# EAGLE design ZX_Distance_and_Gesture_Sensor_PTH (EAGLE 7.2.0)
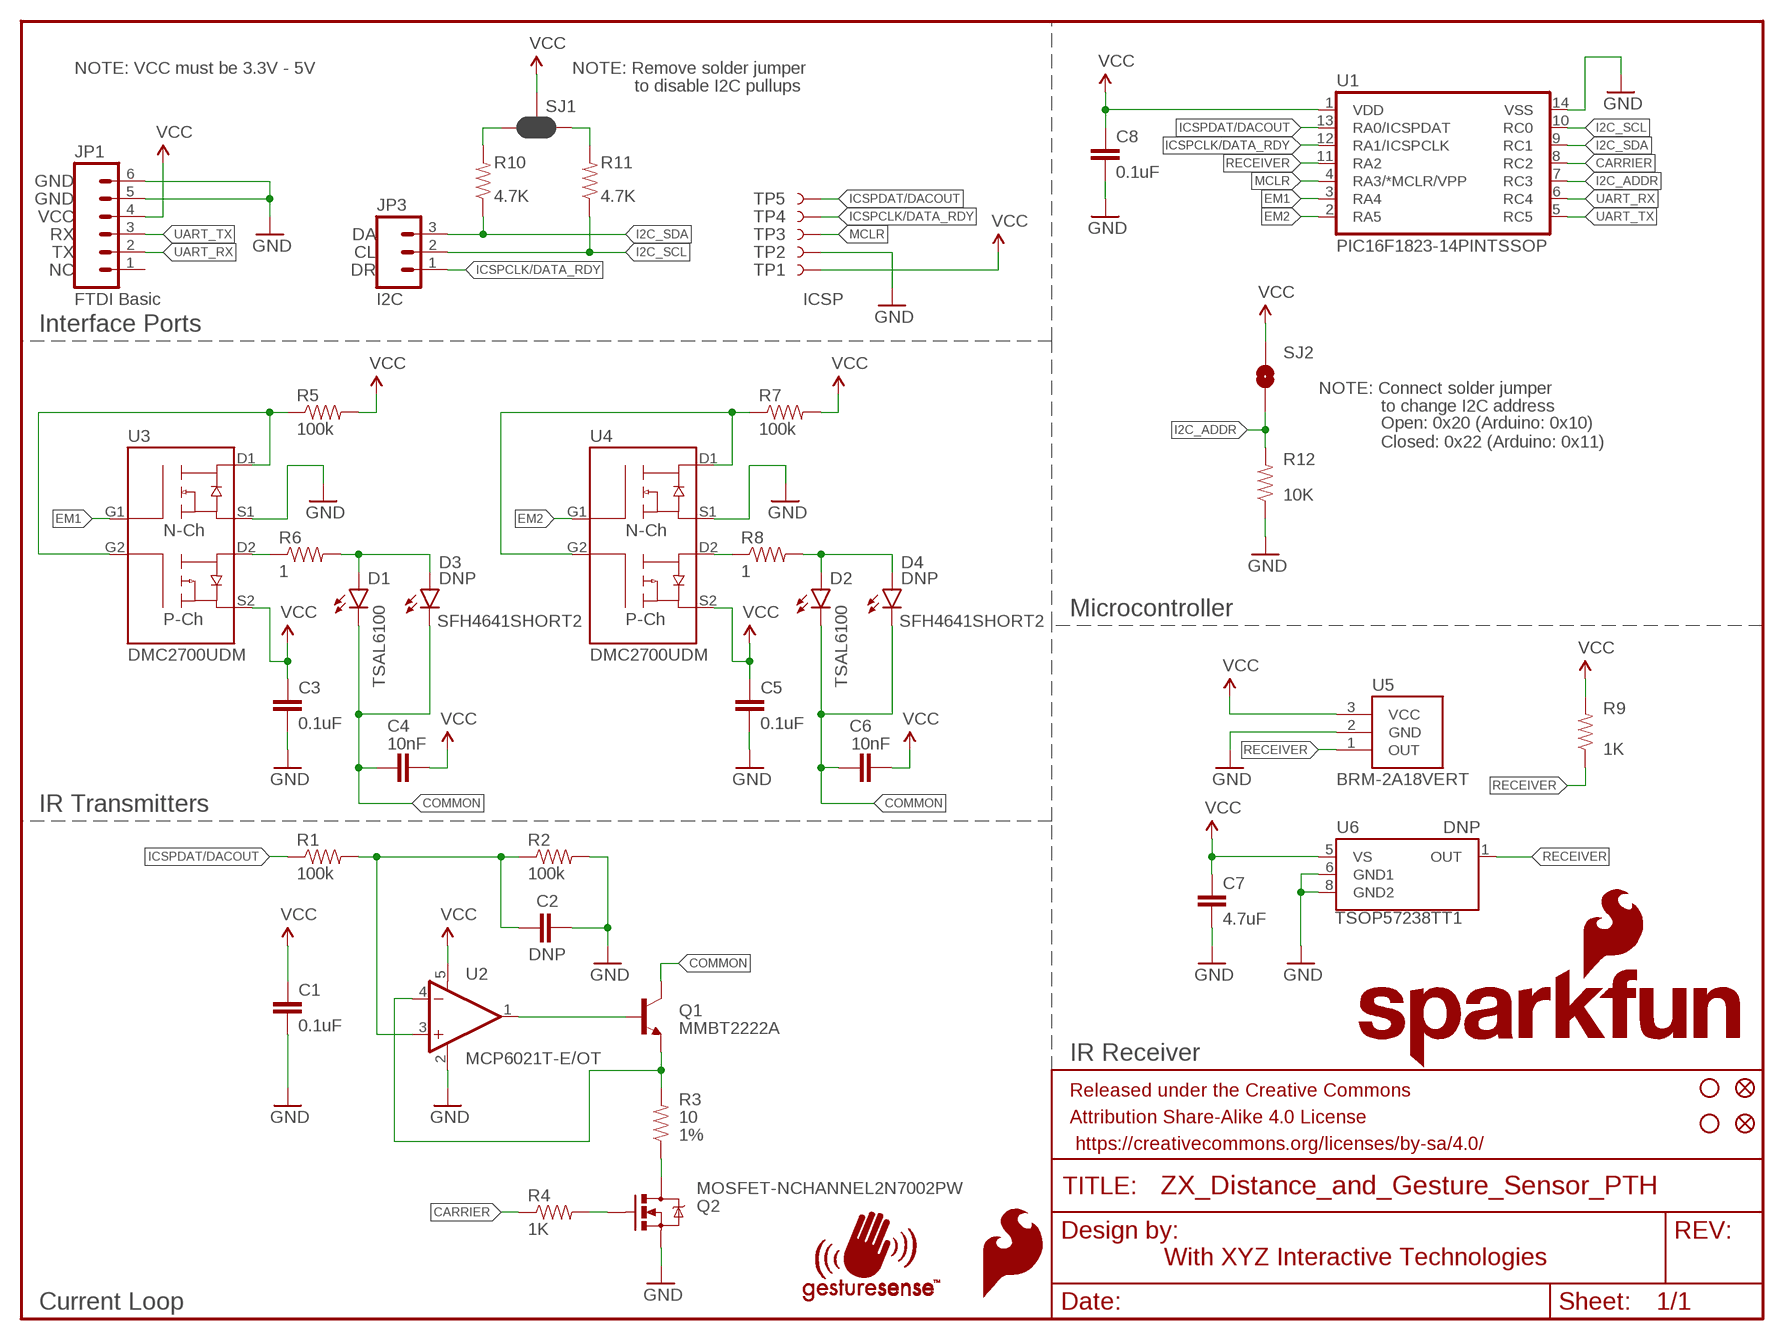
[diagram p0: schematic, sheet 1]

## Parts
C1  0.1uF  0.1UF-25V(+80/-20%)(0603)  [0603-CAP]
C2  DNP  CAP0603-CAP  [0603-CAP]
C3  0.1uF  0.1UF-25V(+80/-20%)(0603)  [0603-CAP]
C4  10nF  10NF/10000PF-50V-10%(0603)  [0603-CAP]
C5  0.1uF  0.1UF-25V(+80/-20%)(0603)  [0603-CAP]
C6  10nF  10NF/10000PF-50V-10%(0603)  [0603-CAP]
C7  4.7uF  4.7UF-6.3V-10%(0603)0603  [0603-CAP]
C8  0.1uF  0.1UF-25V(+80/-20%)(0603)  [0603-CAP]
D1  LED-IR-THRUTSAL6100  [LED5MM]
D2  LED-IR-THRUTSAL6100  [LED5MM]
D3  SFH4641SHORT2  [SFH4641-SHORT2]
D4  SFH4641SHORT2  [SFH4641-SHORT2]
FID1  FIDUCIAL1X2  [FIDUCIAL-1X2]
FID2  FIDUCIAL1X2  [FIDUCIAL-1X2]
FRAME1  FRAME-LETTER  [CREATIVE_COMMONS]
JP1  M06NO_SILK_FEMALE_PTH  [1X06_NO_SILK]
JP3  M031X03_NO_SILK  [1X03_NO_SILK]
LOGO1  SFE_LOGO_FLAME.1_INCH  [SFE_LOGO_FLAME_.1]
Q1  MMBT2222A  TRANSISTOR_NPNMMBT2222A  [SOT23-3]
Q2  MOSFET-NCHANNEL2N7002PW  [SOT323]
R1  100k  100KOHM-1/10W-1%(0603)  [0603-RES]
R2  100k  100KOHM-1/10W-1%(0603)  [0603-RES]
R3  10  10OHM-1/10W-1%(0603)SMD  [0603-RES]
R4  1K  1KOHM-1/10W-1%(0603)  [0603-RES]
R5  100k  100KOHM-1/10W-1%(0603)  [0603-RES]
R6  1  1OHM1/10W1%(0603)  [0603-RES]
R7  100k  100KOHM-1/10W-1%(0603)  [0603-RES]
R8  1  1OHM1/10W1%(0603)  [0603-RES]
R9  1K  1KOHM-1/10W-1%(0603)  [0603-RES]
R10  4.7K  4.7KOHM-1/10W-1%(0603)  [0603-RES]
R11  4.7K  4.7KOHM-1/10W-1%(0603)  [0603-RES]
R12  10K  10KOHM-1/10W-1%(0603)0603  [0603-RES]
SJ1  JUMPER-PAD-3-NC_BY_PASTE  [PAD-JUMPER-3-NC_BY_PASTE_YES_SILK_FULL_BOX]
SJ2  JUMPER-PAD-2-NOYES_SILK  [PAD-JUMPER-2-NO_YES_SILK]
STANDOFF1  STAND-OFF  [STAND-OFF]
STANDOFF2  STAND-OFF  [STAND-OFF]
TP1  TEST-POINT3X4  [PAD.03X.04]
TP2  TEST-POINT3X4  [PAD.03X.04]
TP3  TEST-POINT3X4  [PAD.03X.04]
TP4  TEST-POINT3X4  [PAD.03X.04]
TP5  TEST-POINT3X4  [PAD.03X.04]
U1  PIC16F1823-14PINTSSOP  [TSSOP14]
U2  MCP6021T-E/OT  [SOT23-5]
U3  DMC2700UDM  [SOT26]
U4  DMC2700UDM  [SOT26]
U5  BRM-2A18VERT  [BRM-2508_VERT]
U6  TSOP57238TT1  [TSOP572]
U$5  SFE_LOGO_NAME_FLAME.1_INCH  [SFE_LOGO_NAME_FLAME_.1]
U$6  GESTURESENSE_LOGOSTEXT  [GESTURESENSE_TEXT]

## Nets
CARRIER: R4.1 U1.8(RC2)
COMMON: C4.1 C6.1 D1.K(C) D2.K(C) D3.C D4.C Q1.3(C)
EM1: U1.3(RA4) U3.G1
EM2: U1.2(RA5) U4.G1
GND: C1.2 C2.2 C3.2 C5.2 C7.2 C8.2 JP1.5 JP1.6 Q2.2(S) R2.2 R12.1 TP2.P$1 U1.14(VSS) U2.2(V-) U3.S1 U4.S1 U5.2(GND) U6.6(GND1) U6.8(GND2)
I2C_ADDR: R12.2 SJ2.1 U1.7(RC3)
I2C_SCL: JP3.2 R11.1 U1.10(RC0)
I2C_SDA: JP3.3 R10.1 U1.9(RC1)
ICSPCLK/DATA_RDY: JP3.1 TP4.P$1 U1.12(RA1/ICSPCLK)
ICSPDAT/DACOUT: R1.1 TP5.P$1 U1.13(RA0/ICSPDAT)
MCLR: TP3.P$1 U1.4(RA3/*MCLR/VPP)
N$1: C2.1 R1.2 R2.1 U2.3(+IN)
N$2: Q1.2(E) R3.2 U2.4(-IN)
N$3: Q1.1(B) U2.1(OUT)
N$4: Q2.3(D) R3.1
N$5: Q2.1(G) R4.2
N$6: R6.1 U3.D2
N$7: D1.A D3.A R6.2
N$8: R5.1 U3.D1 U3.G2
N$9: R7.1 U4.D1 U4.G2
N$10: R10.2 SJ1.3
N$11: R8.1 U4.D2
N$12: D2.A D4.A R8.2
N$13: R11.2 SJ1.1
RECEIVER: R9.1 U1.11(RA2) U5.1(OUT) U6.1(OUT)
UART_RX: JP1.2 U1.6(RC4)
UART_TX: JP1.3 U1.5(RC5)
VCC: C1.1 C3.1 C4.2 C5.1 C6.2 C7.1 C8.1 JP1.4 R5.2 R7.2 R9.2 SJ1.2 SJ2.2 TP1.P$1 U1.1(VDD) U2.5(V+) U3.S2 U4.S2 U5.3(VCC) U6.5(VS)
Unconnected: JP1.1

## Notes on the sheet
- NOTE: VCC must be 3.3V - 5V | NOTE: Remove solder jumper
- to disable I2C pullups
- GND
- GND
- VCC
- RX | DA
- TX | CL
- NC | DR
- FTDI Basic | I2C | ICSP
- Interface Ports
- NOTE: Connect solder jumper
- to change I2C address
- Open: 0x20 (Arduino: 0x10)
  Closed: 0x22 (Arduino: 0x11)
- DNP | DNP
- Microcontroller
- IR Transmitters
- IR Receiver
- With XYZ Interactive Technologies
- Current Loop

## Library data of the parts
C1 C3 C5 C8 = SparkFun-Capacitors:0.1UF-25V(+80/-20%)(0603): CAP-00810 Ceramic Standard decoupling cap; PROD_ID: CAP-00810
C2 = SparkFun-Capacitors:CAP: Capacitor Standard 0603 ceramic capacitor, and 0.1" leaded capacitor.
C4 C6 = SparkFun-Capacitors:10NF/10000PF-50V-10%(0603): CAP-00867; PROD_ID: CAP-00867
C7 = SparkFun-Capacitors:4.7UF-6.3V-10%(0603): CAP-08280; PROD_ID: CAP-08280
D1 D2 = SparkFun-LED:LED-IR-THRU; PROD_ID: DIO-12058; VARIANT: TSAL6100
D3 D4 = SparkFun-LED:SFH4641; PROD_ID: DIO-11994
FID1 FID2 = SparkFun-Aesthetics:FIDUCIAL: Fiducial Alignment Points Various fiducial points for machine vision alignment.
FRAME1 = SparkFun-Aesthetics:FRAME-LETTER: Schematic Frame Standard 8.5x11 US Letter frame
JP1 = SparkFun-Connectors:M06: Header 6 Standard 6-pin 0.1" header. Use with straight break away headers (SKU : PRT-00116), right angle break away headers (PRT-00553), swiss pins (PRT-00743), machine pins (PRT-00117), and female headers (PRT-00115). Molex polarized connector foot print use with SKU : PRT-08094 with associated crimp pins and housings. NOTES ON THE VARIANTS LOCK and LOCK_LONGPADS... This footprint was designed to help hold the alignment of a through-hole component (i.e. 6-pin header) while soldering it into place. You may notice that each hole has been shifted either up or down by 0.005 of an inch from it's more standard position (which is a perfectly straight line). This slight alteration caused the pins (the squares in the middle) to touch the edges of the holes. Because they are alternating, it causes a "brace" to hold the component in place. 0.005 has proven to be the perfect amount of "off-center" position when using our standard breakaway headers. Although looks a little odd when you look at the bare footprint, once you have a header in there, the alteration is very hard to notice. Also,if you push a header all the way into place, it is covered up entirely on the bottom side. This idea of altering the position of holes to aid alignment will be further integrated into the Sparkfun Library for other footprints. It can help hold any component with 3 or more connection pins.; PROD_ID: CONN-08437
JP3 = SparkFun-Connectors:M03: Header 3 Standard 3-pin 0.1" header. Use with straight break away headers (SKU : PRT-00116), right angle break away headers (PRT-00553), swiss pins (PRT-00743), machine pins (PRT-00117), and female headers (PRT-00115). Molex polarized connector foot print use with SKU : PRT-08232 with associated crimp pins and housings.
LOGO1 = SparkFun-Aesthetics:SFE_LOGO_FLAME: SFE Logo, flame only This is the SparkFun flame logo. The logo on the schematic will always be the same size; the package variant is the height of the flame. Default layer for the logo on the board is tSilk.
Q1 = SparkFun-DiscreteSemi:TRANSISTOR_NPN: Generic NPN BJT MMBT2222A - TRANS-08049 (SOT-23, 1A 40V) MPSA42 - TRANS-09116 (SOT-23, 500mA 300V) MMBT5088LT1G - TRANS-11160 (SOT-23, 50 mA 30V) BC547 - COM-08928 <http://www.sparkfun.com/products/8928> (TO-92 45V 100mA) (1.Collector 2.Base 3.Emitter) 2N3904 - COM-00521 <http://www.sparkfun.com/products/521> (TO-92 40V 200mA) (1.Emitter 2.Base 3.Collector) P2N2222A - COM-12852 <http://www.sparkfun.com/products/12852> (TO-92 40V 600mA) (1.Collector 2.Base 3.Emitter); PROD_ID: TRANS-08049
Q2 = SparkFun-DiscreteSemi:MOSFET-NCHANNEL: Common NMOSFET Parts MFG P/N Store ID Prod ID FDD8780 TRANS-09984 SI7820DN TRANS-11055 FDS6630A IC-08089 2N7002PW TRANS-11151 FQP30N06L COM-10213 TRANS-10060 BSS123LT1G TRANS-08345 BSS138 TRANS-00830 BS170 2N7000; PROD_ID: TRANS-11151
R1 R2 R5 R7 = SparkFun-Resistors:100KOHM-1/10W-1%(0603): RES-07828; PROD_ID: RES-07828
R3 = SparkFun-Resistors:10OHM-1/10W-1%(0603): RES-12581; PROD_ID: RES-12581; TOL: 1%
R4 R9 = SparkFun-Resistors:1KOHM-1/10W-1%(0603): RES-07856; PROD_ID: RES-07856
R6 R8 = SparkFun-Resistors:1OHM1/10W1%(0603): RES-08269; PROD_ID: RES-08269
R10 R11 = SparkFun-Resistors:4.7KOHM-1/10W-1%(0603): RES-07857; PROD_ID: RES-07857
R12 = SparkFun-Resistors:10KOHM-1/10W-1%(0603): RES-00824; PROD_ID: RES-00824
SJ1 = SparkFun-Passives:JUMPER-PAD-3-NC_BY_PASTE
SJ2 = SparkFun-Passives:JUMPER-PAD-2-NO
STANDOFF1 STANDOFF2 = SparkFun-Electromechanical:STAND-OFF: #4 Stand Off This is the mechanical footprint for a #4 phillips button head screw. Use the keepout ring to avoid running the screw head into surrounding components. SKU : PRT-00447
TP1-TP5 = SparkFun-Passives:TEST-POINT: Bare copper test points for troubleshooting or ICT
U1 = SparkFun-DigitalIC:PIC16F1823-14PIN; PROD_ID: IC-11992
U2 = SparkFun-AnalogIC:MCP6021: Rail-to-rail input/output op-amp with 10 MHz bandwidth.; PROD_ID: IC-12504
U3 U4 = SparkFun-DiscreteSemi:DMC2700UDM; PROD_ID: TRANS-11993
U5 = SparkFun-Sensors:BRM-2A18: BRM-2A18 IR receiver.; PROD_ID: COMP-12505
U6 = SparkFun-Sensors:TSOP57238TT1; PLACE: DNP; PROD_ID: COMP-11990
U$5 = SparkFun-Aesthetics:SFE_LOGO_NAME_FLAME: SFE Logo, name and flame This is the SparkFun full logo. The logo on the schematic will always be the same size; the package variant is the height of the flame part of the logo. Default layer for the logo on the board is tSilk.
U$6 = SparkFun-Aesthetics:GESTURESENSE_LOGOS

## Board
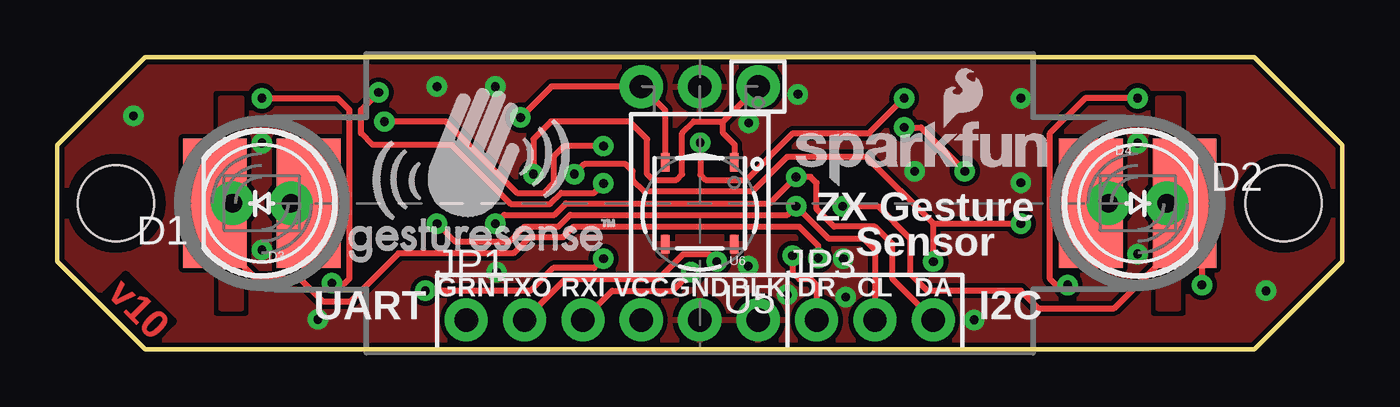
[diagram p1: board, top side]
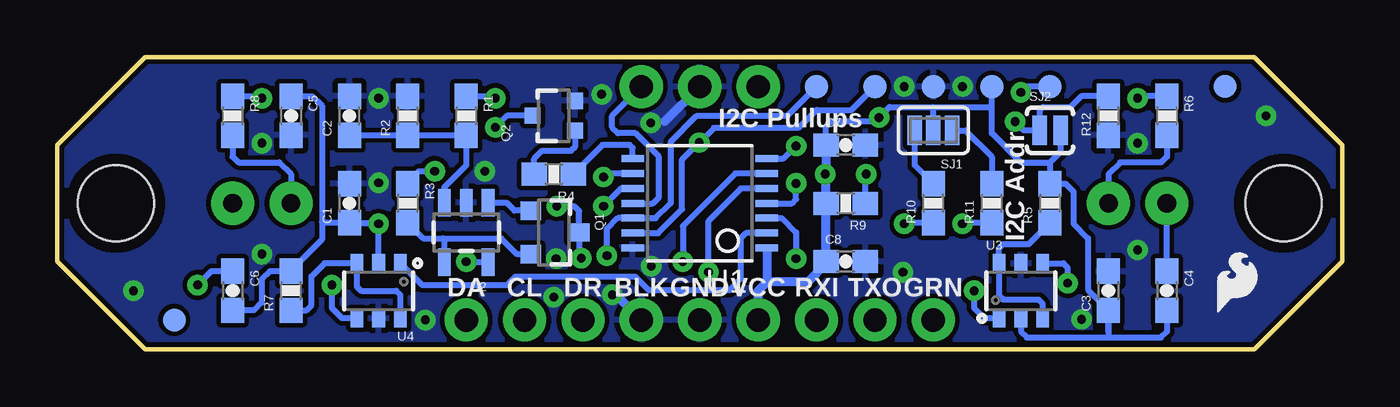
[diagram p2: board, bottom side, seen from below]

Size 55.88 x 12.7 mm. Coordinates in mm from the lower left corner, seen from the top.
Outline: 3.81,12.7 52.07,12.7 55.88,8.89 55.88,3.81 52.07,0 3.81,0 0,3.81 0,8.89 3.81,12.7
Copper layers (1*16): Top 0.035mm / dielectric 1.5mm / Bottom 0.035mm
Design rules "SparkFun-2-layer": minimum track width 7mil, minimum drill 15mil, track to track 8mil, track to pad 8mil, pad to pad 8mil, via to via 8mil, smd to smd 8mil, copper to edge 8mil, drill to drill 8mil, minimum pad ring 12mil, minimum via ring 10mil, stop-mask expansion 4mil, vias tented up to drill 20mil, thermal gap 10mil
bRestrict: 2 lines

### Footprints (pad centres in the part's own frame; a part is rotated, then mirrored left to right if it is on the bottom)
0603-CAP = smd 1.1 x 1: 1 -0.85,0; 2 0.85,0
LED5MM = drill 0.813 pad 1.88: A -1.27,0; K 1.27,0
SFH4641-SHORT2 = smd 5.62 x 2.77: A 0,-2.035; C 0,2.035
FIDUCIAL-1X2 = smd 1 x 1: 1 0,0
1X06_NO_SILK = drill 1.016 pad 1.88: 1 0,0; 2 2.54,0; 3 5.08,0; 4 7.62,0; 5 10.16,0; 6 12.7,0
1X03_NO_SILK = drill 1.016 pad 1.88: 1 0,0; 2 2.54,0; 3 5.08,0
SOT23-3 = smd 0.8 x 0.9: 1 -0.95,-1; 2 0.95,-1; 3 0,1.1
SOT323 = smd 0.7 x 0.7: 1 -0.65,-0.925; 2 0.65,-0.925; 3 0,0.925
0603-RES = smd 1.1 x 1: 1 -0.85,0; 2 0.85,0
PAD-JUMPER-3-NC_BY_PASTE_YES_SILK_FULL_BOX = smd 0.635 x 1.27: 1 -0.813,0; 2 0,0; 3 0.813,0
PAD-JUMPER-2-NO_YES_SILK = smd 0.635 x 1.27: 1 -0.45,0; 2 0.45,0
STAND-OFF = hole 3.302: 0,0
PAD.03X.04 = smd 1.016 x 1.016: P$1 0,0
TSSOP14 = smd 0.305 x 0.991: 1 -1.95,-2.918; 2 -1.3,-2.918; 3 -0.65,-2.918; 4 0,-2.918; 5 0.65,-2.918; 6 1.3,-2.918; 7 1.95,-2.918; 8 1.95,2.918; 9 1.3,2.918; 10 0.65,2.918; 11 0,2.918; 12 -0.65,2.918; 13 -1.3,2.918; 14 -1.95,2.918
SOT23-5 = smd 0.55 x 1.2: 1 -0.95,-1.3; 2 0,-1.3; 3 0.95,-1.3; 4 0.95,1.3; 5 -0.95,1.3
SOT26 = smd 0.55 x 0.8: D1 -0.95,1.2; D2 0.95,1.2; G1 -0.95,-1.2; G2 0.95,-1.2; S1 0,1.2; S2 0,-1.2
BRM-2508_VERT = drill 1.016 pad 1.88: 1 -2.54,0; 2 0,0; 3 2.54,0
TSOP572 = smd 0.35 x 0.8: 1 -1.5,-1.775; 5 1.5,-1.775; 6 1.5,1.775; 8 -1.5,1.775

### Placement (x,y rotation side)
C1  43.18,6.35 90 bottom
C2  43.18,10.16 90 bottom
C3  10.16,2.54 90 bottom
C4  7.62,2.54 270 bottom
C5  45.72,10.16 270 bottom
C6  48.26,2.54 270 bottom
C7  21.59,8.89 0 bottom
C8  21.59,3.81 0 bottom
D1  8.89,6.35 180 top
D2  46.99,6.35 0 top
D3  8.89,6.35 90 top
D4  46.99,6.35 270 top
FID1  5.08,11.43 0 bottom
FID2  50.8,1.27 0 bottom
FRAME1  2.54,-11.43 0 top  (outside the outline)
JP1  17.78,1.27 0 top
JP3  33.02,1.27 0 top
LOGO1  5.71,1.27 0 bottom
Q1  34.29,5.08 270 bottom
Q2  34.29,10.16 90 bottom
R1  38.1,10.16 270 bottom
R2  40.64,10.16 90 bottom
R3  40.64,6.35 270 bottom
R4  34.29,7.62 180 bottom
R5  12.7,6.35 90 bottom
R6  7.62,10.16 270 bottom
R7  45.72,2.54 90 bottom
R8  48.26,10.16 270 bottom
R9  21.59,6.35 180 bottom
R10  17.78,6.35 90 bottom
R11  15.24,6.35 90 bottom
R12  10.16,10.16 90 bottom
SJ1  17.78,9.52 180 bottom
SJ2  12.7,9.52 0 bottom
STANDOFF1  2.54,6.35 0 top
STANDOFF2  53.34,6.35 0 top
TP1  15.24,11.43 90 bottom
TP2  17.78,11.43 0 bottom
TP3  12.7,11.43 0 bottom
TP4  22.86,11.43 0 bottom
TP5  20.32,11.43 0 bottom
U1  27.94,6.35 90 bottom
U2  38.1,5.08 180 bottom
U3  13.97,2.54 0 bottom
U4  41.91,2.54 180 bottom
U5  27.94,11.43 180 top
U6  27.94,6.35 180 top
U$5  31.7,7.01 0 top
U$6  12.7,3.81 0 top

### Tracks (layer width: path | path; a pad name or v marks a point on that pad's centre or on a via)
CARRIER
  Bottom 0.254: R4.1 32.17,8.89 30.99,8.89 30.86,8.76 U1.8
COMMON  (via drill 0.38)
  Top 0.254: v33.1,3.96 33.1,4.5 32.26,5.33 22.45,5.33 22,4.88 20.55,4.88 19.84,4.17 14.83,4.17 12.75,2.08 11.53,2.08 10.57,3.05 8.64,3.05 6.86,4.83 D3.C D1.K | v34.16,6.22 35.69,6.22 37.08,4.83 37.08,3.3 37.85,2.54 41.91,2.54 42.67,1.78 45.97,1.78 49.02,4.83 | D2.K D4.C 49.02,4.83 | 49.02,4.83 49.78,4.06 v49.78,2.79
  Bottom 0.254: v33.1,3.96 33.19,4.06 Q1.3 33.19,6.01 33.4,6.22 v34.16,6.22 | C6.1 49.19,3.39 v49.78,2.79 | C4.1 D1.K
EM1  (via drill 0.38)
  Top 0.254: v16,2.54 20.57,2.54 21.57,3.53 23.34,3.53 v23.75,3.94
  Bottom 0.254: U1.3 24.37,5.7 23.75,5.08 v23.75,3.94 | U3.G1 15.56,1.34 16,1.78 v16,2.54
EM2
  Bottom 0.254: U1.2 25.94,5.05 26.16,4.83 26.16,3.05 26.65,2.56 30.15,2.56 30.73,3.15 35.97,3.15 36.32,2.79 40.01,2.79 U4.G1
GND  (via drill 0.38)
  Bottom 0.254: v34.19,3.94 34.16,3.94
  Bottom 0.381: 29.46,9.91 U5.2 | 31.75,2.54 JP1.6
  other vias: 8.89,8.97 8.89,4.32 34.29,2.26 37.29,7.75 41.91,10.92 46.99,8.97 41.91,7.24 39.88,1.27 30.05,3.61 16.51,11.43 11.33,1.3 30.07,9.86 52.58,2.54 3.3,10.16 19.05,11.43 19.1,3.35 32.21,11.1 31.75,2.36 46.99,4.14
  pour Top (isolate 0.203, rank 5): 3.81,0 52.07,0 55.88,3.81 55.88,8.89 52.07,12.7 3.81,12.7 0,8.89 0,3.81
  pour Bottom (isolate 0.203): 3.81,0 52.07,0 55.88,3.81 55.88,8.89 52.07,12.7 3.81,12.7 0,8.89 0,3.81
I2C_ADDR  (via drill 0.38)
  Top 0.254: v23.75,8.84 22.05,8.84 21.59,8.38 21.59,7.24 21.16,6.81 19.99,6.81 16.89,9.91 v14.22,9.91
  Bottom 0.254: R12.2 11.34,11.01 11.81,10.54 13.01,10.54 13.15,10.4 SJ2.1 13.84,9.52 v14.22,9.91 | U1.7 24.29,8.3 v23.75,8.84
I2C_SCL  (via drill 0.38)
  Top 0.254: JP3.2 35.56,4.32 35.05,4.83 33.53,4.83 v32.13,6.22 31.75,5.84 22.3,5.84 21.79,5.33 20.32,5.33 19.66,4.67 17.3,4.67 v16.51,5.46
  Bottom 0.254: R11.1 16.47,5.5 v16.51,5.46 | U1.10 31.35,7 v32.13,6.22
I2C_SDA  (via drill 0.38)
  Top 0.254: JP3.3 36.32,3.05 36.32,4.57 35.56,5.33 33.78,5.33 33.02,6.1 33.02,7.24 32.77,7.49 v32.13,7.49 31.18,6.54 30.99,6.35 22.12,6.35 21.62,5.84 19.43,5.84 v19.05,5.46
  Bottom 0.254: R10.1 19.01,5.5 v19.05,5.46 | U1.9 31.97,7.65 v32.13,7.49
ICSPCLK/DATA_RDY  (via drill 0.38)
  Top 0.254: v31.98,4.06 31.98,3.33 32.26,3.05 32.77,3.05 33.02,2.79 JP3.1
  Bottom 0.254: TP4.P$1 24.16,10.13 28.09,10.13 29.21,9.02 29.21,6.35 29.86,5.7 U1.12 31.51,5.7 31.98,5.23 v31.98,4.06
ICSPDAT/DACOUT  (via drill 0.38)
  Top 0.254: v36.83,10.92 35.31,9.4 32,9.4 29.97,7.37 28.19,7.37 27.96,7.59 v27.96,8.99
  Bottom 0.254: R1.1 36.92,11.01 v36.83,10.92 | TP5.P$1 21.34,10.41 22.86,10.41 23.65,9.63 27.33,9.63 v27.96,8.99 28.7,8.25 28.7,6.1 29.75,5.05 U1.13
MCLR  (via drill 0.38)
  Top 0.254: v23.75,7.21 23.34,6.81 21.92,6.81 21.44,6.32 19.71,6.32 17.15,8.89 13.72,8.89 13.21,9.4 13.21,10.41 v13.97,11.18
  Bottom 0.254: U1.4 23.93,6.35 23.75,6.53 v23.75,7.21 | TP3.P$1 13.72,11.43 v13.97,11.18
N$1
  Bottom 0.254: C2.1 R2.1 R1.2 38.1,8 39.05,7.05 U2.3
N$2
  Bottom 0.254: Q1.2 35.88,4.13 36.58,4.83 39.12,4.83 | 39.12,4.83 39.97,4.83 R3.2 | U2.4 39.05,4.76 39.12,4.83
N$3
  Bottom 0.254: U2.1 36.35,6.38 36,6.03 Q1.1
N$4  (via drill 0.38)
  Top 0.254: v36.83,9.65 37.57,9.65 v39.47,7.75
  Bottom 0.254: Q2.3 36.32,10.16 v36.83,9.65 | R3.1 40.64,7.26 40.16,7.75 v39.47,7.75
N$5
  Bottom 0.254: Q2.1 33.37,8.8 33.53,8.64 34.8,8.64 35.14,8.29 R4.2
N$6  (via drill 0.38)
  Top 0.254: v8.89,10.92 12.19,10.92 12.7,10.41 12.7,3.07 12.5,2.87 v11.94,2.87
  Bottom 0.254: R6.1 8.8,11.01 v8.89,10.92 | U3.D2 12.12,3.74 11.94,3.56 v11.94,2.87
N$7
  Top 0.254: D3.A D1.A
  Bottom 0.254: R6.2 7.62,8.38 7.87,8.13 9.65,8.13 10.16,7.62 D1.A
N$8
  Bottom 0.254: R5.1 13.63,4.57 14.73,4.57 14.92,4.38 U3.D1 14.92,2.35 14.73,2.16 13.21,2.16 13.02,1.97 U3.G2
N$9
  Bottom 0.254: U4.D1 40.96,2.35 41.15,2.54 42.67,2.54 42.86,2.73 U4.G2 44.27,3.74 44.83,3.17 44.83,1.9 45.05,1.69 R7.1
N$10
  Bottom 0.254: SJ1.3 18.59,8.01 R10.2
N$11  (via drill 0.38)
  Top 0.254: v46.99,10.92 44.7,10.92 43.18,9.4 43.18,3.05 43.43,2.79 v43.94,2.79
  Bottom 0.254: U4.D2 43.5,1.34 43.94,1.78 v43.94,2.79 | R8.1 47.08,11.01 v46.99,10.92
N$12
  Top 0.254: D4.A D2.A
  Bottom 0.254: R8.2 48.26,8.38 48.01,8.13 46.23,8.13 45.72,7.62 D2.A
N$13
  Bottom 0.254: SJ1.1 16.38,9.52 15.24,8.38 R11.2
N$15
  pour Top (isolate 0.305): 7.11,10.92 8,10.92 8,9.65 7.11,9.65
N$16
  pour Top (isolate 0.305): 48.77,3.05 47.88,3.05 47.88,1.78 48.77,1.78
N$17
  pour Top (isolate 0.305): 48.77,9.65 47.88,9.65 47.88,10.92 48.77,10.92
N$18
  pour Top (isolate 0.305): 7.11,3.05 7.11,1.78 8,1.78 8,3.05
RECEIVER  (via drill 0.38)
  Top 0.254: v20.7,7.62 20.7,9.14 21.46,9.91 24.89,9.91 25.65,9.14 25.65,7.62 25.91,7.37 26.92,7.37 27.18,7.62 27.18,9.4 27.69,9.91 28.96,9.91 | U6.1 29.46,8.15 29.46,8.89 28.96,9.4 28.96,9.91 | 28.96,9.91 U5.1
  Bottom 0.254: R9.1 20.74,7.58 v20.7,7.62 | U1.11 29.97,6.35 29.72,6.6 29.72,8.38 30.73,9.4 31.5,9.4 31.75,9.65 31.75,10.16 U5.1
UART_RX  (via drill 0.38)
  Top 0.254: JP1.2 22.1,3.05 26.14,3.05 27.23,4.14 28.35,4.14 v28.68,3.81
  Bottom 0.254: U1.6 26.39,7.65 28.68,5.36 v28.68,3.81
UART_TX  (via drill 0.38)
  Top 0.254: JP1.3 24.13,2.54 26.75,2.54 v27.56,3.35
  Bottom 0.254: U1.5 26.15,7 27.56,5.59 v27.56,3.35
VCC  (via drill 0.38)
  Top 0.254: U6.5 26.44,10.39 U5.3 21.49,11.43 v20.14,10.08 | v38.1,3.81 38.1,5.46 | 38.1,5.46 v41.91,5.46 | v22.48,7.62 22.91,8.05 24.71,8.05 25.02,7.75 25.02,7.37 25.53,6.86 30.23,6.86 31.75,8.38 35.18,8.38 38.1,5.46
  Bottom 0.254: C5.1 44.79,11.01 44.37,10.59 44.37,5.54 | 15.24,10.54 TP1.P$1 | 12.7,8.13 R5.2 12.03,7.2 11.68,6.86 11.68,5.46 11.05,4.83 11.05,2.58 C3.1 | SJ1.2 17.78,10.54 | 17.78,10.54 19.69,10.54 v20.14,10.08 20.32,9.91 22.23,9.91 22.44,9.69 C7.1 | 17.78,10.54 15.24,10.54 | U3.S2 13.97,0.76 13.72,0.51 10.16,0.51 | 10.16,0.51 7.87,0.51 7.62,0.76 C4.2 | SJ2.2 12.25,8.58 12.7,8.13 | 12.7,8.13 13.97,8.13 15.24,9.4 15.24,10.54 | U1.1 25.02,4.35 25.02,4.34 | U2.5 38.07,3.78 v38.1,3.81 | U4.S2 v41.91,5.46 41.95,5.5 C1.1 44.34,5.5 44.37,5.54 | 44.37,5.54 44.37,4.77 45.72,3.43 R7.2 46.65,3.39 46.99,3.05 46.99,2.03 47.33,1.69 C6.2 | 10.16,0.76 C3.1 | C3.1 10.16,0.51
  Bottom 0.381: 25.02,2.92 25.4,2.54 JP1.4 | 25.02,2.92 23.24,2.92 22.44,3.72 C8.1 R9.2 22.44,7.58 v22.48,7.62 22.44,7.66 C7.1 | 25.02,4.34 25.02,2.92

### Text on the board
Top: v10
tPlace: ZX Gesture | Sensor | UART | GRN | TXO | RXI | VCC | GND | BLK | DR | CL | DA | I2C
bPlace: I2C Pullups | I2C Addr | GRN | TXO | RXI | VCC | GND | BLK | DR | CL | DA
tDocu: Shawn Hymel (SparkFun Electronics) / with XYZ Interactive Technologies